# Altium project lamp_controller.PrjPcb (part 4 of 4)
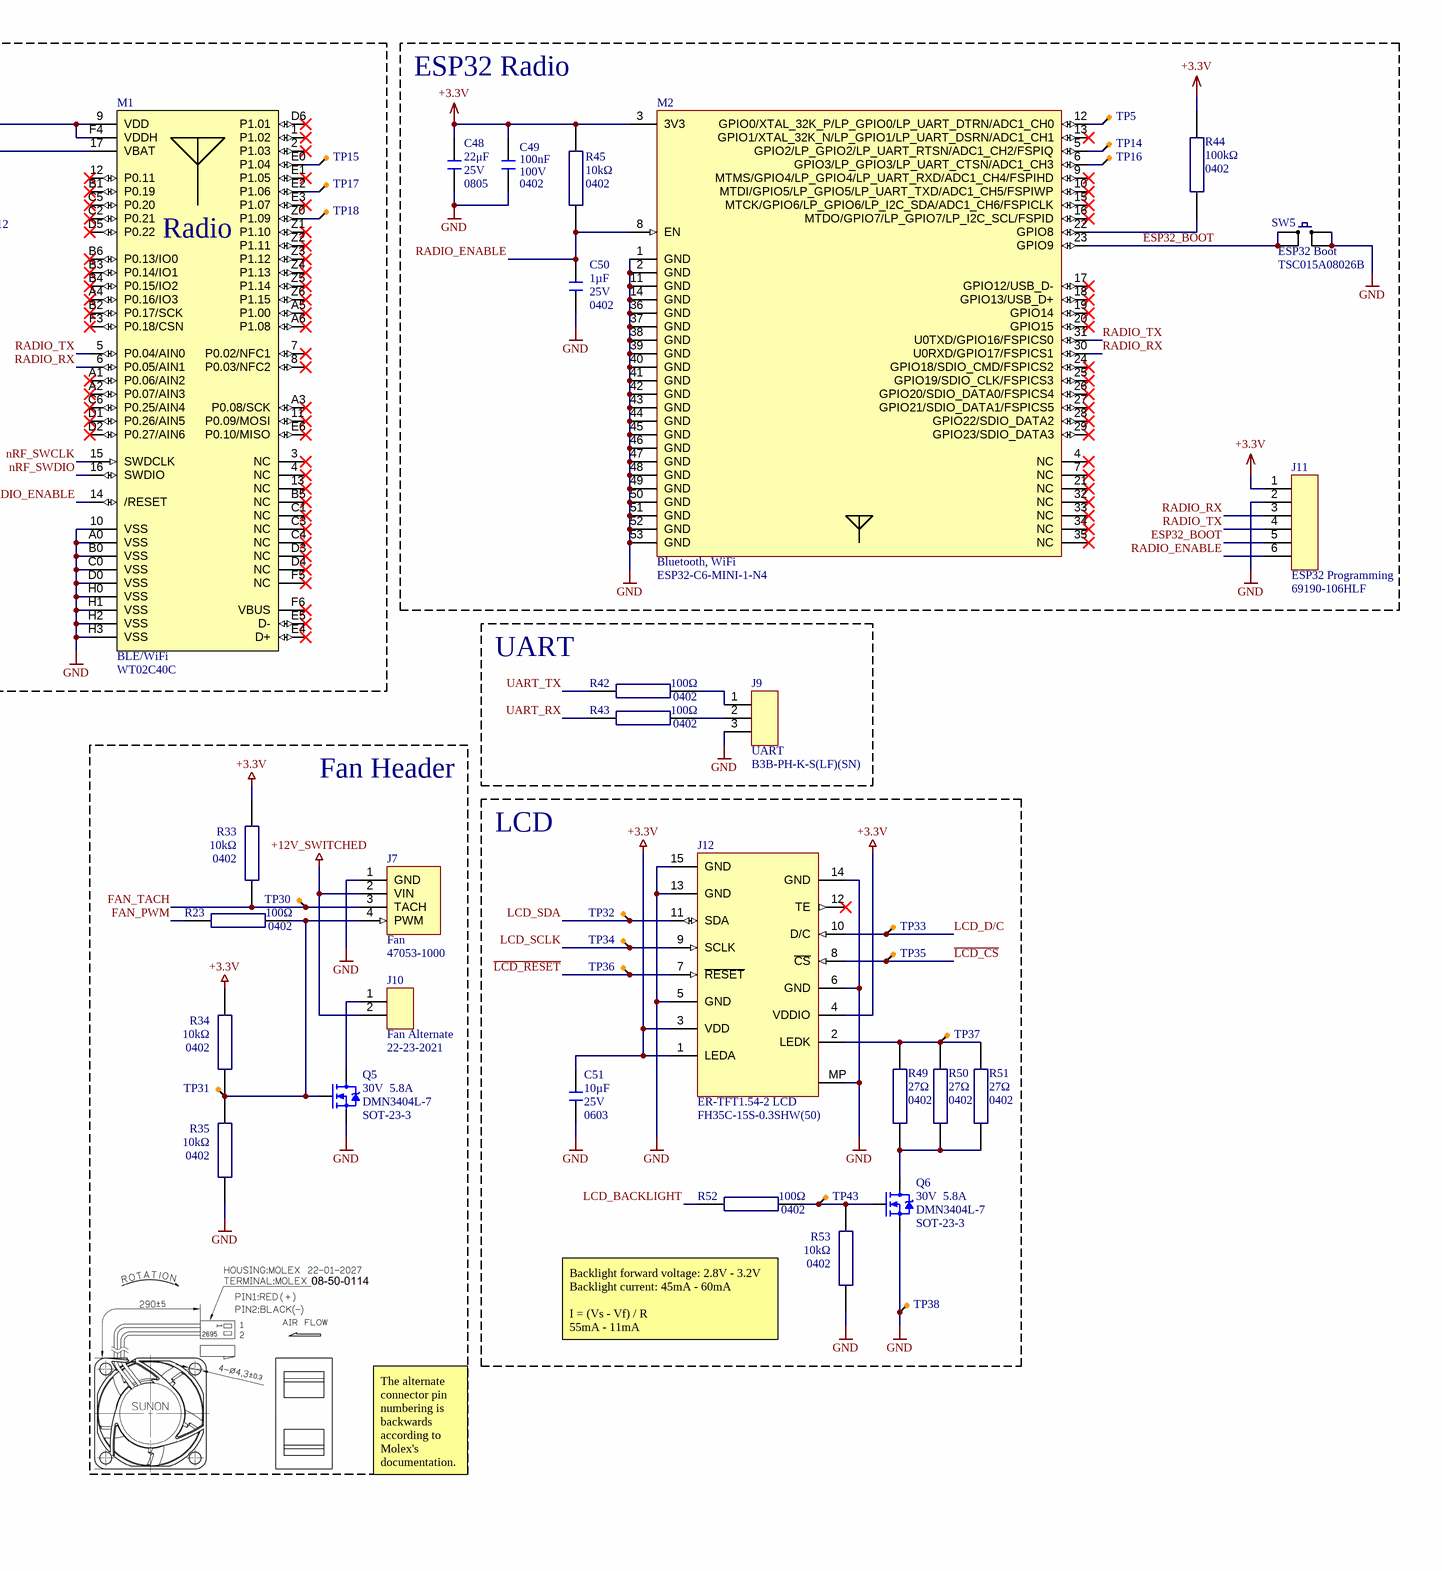
[diagram p5: lamp_controller.SchDoc, right]

## Sheet lamp_controller.SchDoc: Lamp Controller (continued)

### Library data of the parts
C8-C15 C18 C19 C35 C42-C44 C49 C52-C54 = GRM155R62A104KE14D: 100 nF, 100 V, X7R, 0402 Chip capacitor; Manufacturer: Murata; Dielectric Material: Ceramic; Multilayer: Yes; Tolerance  (fill in as +-): 10%; Temperature Characteristics Code: X5R; Supplier 1: LCSC; Supplier Part Number 1: C162178; RoHS: Yes; Category: Ceramic Capacitors; Pricing 1: 50=0.0085, 500=0.0066, 1500=0.0057, 10000=0.0051, 20000=0.0048, 50000=0.0047 (USD); Min Operating Temperature: -55°C; Max Operating Temperature: 85°C; Packaging: Tape and Reel; Termination: Wraparound; RoHS Compliant: Yes; ComponentLink1URL: https://datasheet.ciiva.com:443/pdfs/VipMasterIC/IC/MURE/MURE-S-A0004362469/MURE-S-A0004364737-1.pdf?src-supplier=IHS+Markit; ComponentLink1Description: https://datasheet.ciiva.com:443/pdfs/VipMasterIC/IC/MURE/MURE-S-A0004362469/MURE-S-A0004364737-1.pdf?src-supplier=IHS+Markit; ComponentLink2URL: http://www.farnell.com/datasheets/2079151.pdf?src-supplier=Farnell; ComponentLink2Description: http://www.farnell.com/datasheets/2079151.pdf?src-supplier=Farnell; ComponentLink3URL: http://www.mouser.com/ds/2/281/c02e-2905.pdf?src-supplier=Mouser; ComponentLink3Description: http://www.mouser.com/ds/2/281/c02e-2905.pdf?src-supplier=Mouser; ComponentLink4URL: http://www.farnell.com/datasheets/2079151.pdf?src-supplier=Element14; ComponentLink4Description: http://www.farnell.com/datasheets/2079151.pdf?src-supplier=Element14; ComponentLink5URL: http://www.farnell.com/datasheets/2079151.pdf?src-supplier=Newark; ComponentLink5Description: http://www.farnell.com/datasheets/2079151.pdf?src-supplier=Newark; ComponentLink6URL: https://datasheet.octopart.com/GRM155R62A104KE14D-Murata-datasheet-149523038.pdf?src-supplier=Newark; ComponentLink6Description: https://datasheet.octopart.com/GRM155R62A104KE14D-Murata-datasheet-149523038.pdf?src-supplier=Newark; ComponentLink7URL: https://datasheet.octopart.com/GRM155R62A104KE14D-Murata-datasheet-66077071.pdf?src-supplier=Element14; ComponentLink7Description: https://datasheet.octopart.com/GRM155R62A104KE14D-Murata-datasheet-66077071.pdf?src-supplier=Element14; ComponentLink8URL: http://search.murata.co.jp/Ceramy/image/img/A01X/G101/ENG/GRM155R62A104KE14-01.pdf?src-supplier=Digikey; ComponentLink8Description: http://search.murata.co.jp/Ceramy/image/img/A01X/G101/ENG/GRM155R62A104KE14-01.pdf?src-supplier=Digikey; ComponentLink9URL: https://datasheet.octopart.com/GRM155R62A104KE14D-Murata-datasheet-22122223.pdf?src-supplier=Future+Electronics; ComponentLink9Description: https://datasheet.octopart.com/GRM155R62A104KE14D-Murata-datasheet-22122223.pdf?src-supplier=Future+Electronics; Manufacturer Part Number: GRM155R62A104KE14D; Stock 1: 283300; Mounting Technology: Surface Mount; Pins: 2; Package Shape: Rectangular; Terminal Finish: Nickel; JESD-609 Code: e3; Capacitor Type: Ceramic; Tolerance (fill in as +-): 10%; Reach SVHC Compliant: Yes; ComponentLink10URL: https://datasheet.octopart.com/GRM155R62A104KE14D-Murata-datasheet-165579666.pdf?src-supplier=TME; ComponentLink10Description: https://datasheet.octopart.com/GRM155R62A104KE14D-Murata-datasheet-165579666.pdf?src-supplier=TME
C16 C17 C36 C50 = GRM155R61E105KA12D: 1 µF, 25 V, X5R, 0402 Chip capacitor; Manufacturer: Murata; house_part_number: C-1uF-0402-002; Dielectric Material: Ceramic; Multilayer: Yes; Negative Tolerance: 10%; Supplier 1: Digi-Key; Supplier Part Number 1: 490-10017-1-ND; RoHS: Yes; Category: Ceramic Capacitors; Stock 1: 145965; Pricing 1: 1=0.11000, 10=0.08300, 50=0.04560, 100=0.03720, 500=0.02656, 1000=0.02087, 2500=0.01898, 5000=0.01746 (USD); Mount: Surface Mount; Number of Pins: 2; Package Shape: Rectangular; Terminal Finish: Nickel; Min Operating Temperature: -55°C; Max Operating Temperature: 85°C; JESD-609 Code: e3; Capacitor Type: Ceramic; Package Style: SMTMeter; Packaging: Tape and Reel; Positive Tolerance: 10%; Temperature Characteristics Code: X5R; Termination: Wraparound; Length: 1mm; Width: 0.5mm; Height: 0.5mm; REACH SVHC: Yes; RoHS Compliant: Yes; ComponentLink1URL: https://datasheet.ciiva.com:443/pdfs/VipMasterIC/IC/MURE/MURE-S-A0004362469/MURE-S-A0004364524-1.pdf?src-supplier=IHS+Markit; ComponentLink1Description: https://datasheet.ciiva.com:443/pdfs/VipMasterIC/IC/MURE/MURE-S-A0004362469/MURE-S-A0004364524-1.pdf?src-supplier=IHS+Markit; ComponentLink2URL: https://datasheet.ciiva.com/7719/1666664-7719006.pdf?src-supplier=Element14; ComponentLink2Description: https://datasheet.ciiva.com/7719/1666664-7719006.pdf?src-supplier=Element14; ComponentLink3URL: https://datasheet.ciiva.com/22732/1666664-22732122.pdf?src-supplier=Element14; ComponentLink3Description: https://datasheet.ciiva.com/22732/1666664-22732122.pdf?src-supplier=Element14; Manufacturer Part Number: GRM155R61E105KA12D
C20 C21 = CC0402JRNPO9BN270: 27 pF, 25 V, X7R, 0402 Chip capacitor; Manufacturer: Yageo; house_part_number: C-27pF-0402-002; Tolerance: 5%; Dielectric: C0G; Supplier 1: Future Electronics; Manufacturer Part Number: CC0402JRNPO9BN270; RoHS: Yes; Category: Ceramic Capacitors; Mounting Technology: Surface Mount; Pins: 2; Min Operating Temperature: -55°C; Max Operating Temperature: 125°C; Packaging: Tape and Reel; Termination: SMD/SMT; Reach SVHC Compliant: No; RoHS Compliant: Yes; ComponentLink1URL: https://datasheet.ciiva.com/26862/getdatasheetpartid-403452-26862597.pdf?src-supplier=Verical; ComponentLink1Description: https://datasheet.ciiva.com/26862/getdatasheetpartid-403452-26862597.pdf?src-supplier=Verical; Supplier Part Number 1: 9741513; Stock: 1230000; Pricing: 10000=0.0024, 40000=0.0022, 150000=0.0021, 400000=0.002, 1000000=0.0019 (USD); Case Code (Metric): 1005; Case Code (Imperial): 0402; Voltage Rating: 50V; Package Quantity: 1; Series: CC; Length: 1mm; Width: 0.02inch; Thickness: 0.022inch; Depth: 0.5mm; Radiation Hardening: No; Lead Free: Lead Free; ComponentLink2URL: https://datasheet.ciiva.com/28450/1443161-28450249.pdf?src-supplier=Element14; ComponentLink2Description: https://datasheet.ciiva.com/28450/1443161-28450249.pdf?src-supplier=Element14; ComponentLink3URL: https://datasheet.ciiva.com/176/mlccorderingcode-176355.pdf?src-supplier=Digikey; ComponentLink3Description: https://datasheet.ciiva.com/176/mlccorderingcode-176355.pdf?src-supplier=Digikey; ComponentLink4URL: https://datasheet.ciiva.com/176/mlccorderingcode-176354.pdf?src-supplier=Digikey; ComponentLink4Description: https://datasheet.ciiva.com/176/mlccorderingcode-176354.pdf?src-supplier=Digikey; ComponentLink5URL: https://datasheet.ciiva.com/176/mlccorderingcode-176356.pdf?src-supplier=Digikey; ComponentLink5Description: https://datasheet.ciiva.com/176/mlccorderingcode-176356.pdf?src-supplier=Digikey; ComponentLink6URL: https://datasheet.ciiva.com/13386/upy-gp-np0-16v-to-50v-8-13386281.pdf?src-supplier=Mouser; ComponentLink6Description: https://datasheet.ciiva.com/13386/upy-gp-np0-16v-to-50v-8-13386281.pdf?src-supplier=Mouser
C34 C51 = CL10A106MA8NRNC: 10 µF, 25 V, X5R, 0603 Chip capacitor; Manufacturer: Samsung; house_part_number: C-10uF-0603-002; Tolerance: 20%; Material: 4241ConductorMaterial; RoHS: Yes; Category: Ceramic Capacitors; Case Code (Metric): 1608; Min Operating Temperature: -55°C; Max Operating Temperature: 85°C; Packaging: Cut Tape; RoHS Compliant: Yes; ComponentLink1URL: https://datasheet.ciiva.com/25766/cl10a106ma8nrnc-25766562.pdf?src-supplier=Digikey; ComponentLink1Description: https://datasheet.ciiva.com/25766/cl10a106ma8nrnc-25766562.pdf?src-supplier=Digikey; Manufacturer Part Number: CL10A106MA8NRNC; Case Code (Imperial): 0603; Stock: 632000; Pricing: 4000=0.0511, 8000=0.046, 12000=0.0434, 28000=0.0413, 100000=0.0356 (USD); Mounting Technology: Surface Mount; Series: CL; Height: 900um; Lead Free: Lead Free; Supplier Part Number 1: CL10A106MA8NRNC; Supplier 1: Arrow Electronics
C39-C41 C48 = GRT21BR61E226ME13L: 22 μF, 25 V, X5R, 0805 Chip capacitor; Manufacturer: Murata; Dielectric Material: Ceramic; Multilayer: Yes; Tolerance  (fill in as +-): 20%; Reference Standard: AEC-Q200; Supplier 1: Digi-Key; RoHS: Yes; Category: Ceramic Capacitors; Stock 1: 1983731; Pricing 1: 1=0.48, 10=0.338, 50=0.2558, 100=0.2228, 500=0.16508, 1000=0.14031 (USD); Mounting Technology: Surface Mount; Pins: 2; Package Shape: Rectangular; Terminal Finish: Nickel; Min Operating Temperature: -55°C; Max Operating Temperature: 85°C; JESD-609 Code: e3; Capacitor Type: Ceramic; Packaging: Tape and Reel; Tolerance (fill in as +-): 20%; Temperature Characteristics Code: X5R; Termination: Wraparound; Reach SVHC Compliant: Yes; RoHS Compliant: Yes; ComponentLink1URL: https://datasheet.ciiva.com:443/pdfs/VipMasterIC/IC/MURE/MURE-S-A0004410517/MURE-S-A0004413512-1.pdf?src-supplier=IHS+Markit; ComponentLink1Description: https://datasheet.ciiva.com:443/pdfs/VipMasterIC/IC/MURE/MURE-S-A0004410517/MURE-S-A0004413512-1.pdf?src-supplier=IHS+Markit; ComponentLink2URL: http://search.murata.co.jp/Ceramy/image/img/A01X/G101/ENG/GRT21BR61E226ME13-01.pdf?src-supplier=Digi-Key; ComponentLink2Description: http://search.murata.co.jp/Ceramy/image/img/A01X/G101/ENG/GRT21BR61E226ME13-01.pdf?src-supplier=Digi-Key; Manufacturer Part Number: GRT21BR61E226ME13L; Supplier Part Number 1: 490-12389-1-ND
J2 = B04B-XASK-1: 4-pin JST XA header, 2.5mm pitch, through-hole; Supplier 1: Digi-Key; Manufacturer: JST; RoHS: No; Category: Connectors; Stock 1: 159148; Pricing 1: 1=0.32, 10=0.269, 100=0.2093, 500=0.17938, 1000=0.14948, 5000=0.12812, 10000=0.11958 (USD); ComponentLink1URL: https://datasheet.ciiva.com/719/exa1-719638.pdf?src-supplier=Digi-Key; ComponentLink1Description: https://datasheet.ciiva.com/719/exa1-719638.pdf?src-supplier=Digi-Key; Supplier Part Number 1: 455-B04B-XASK-1-ND; Manufacturer Part Number: B04B-XASK-1
J4 J5 = debug_header: Tag-connect 6-pin pogo header; pickable: no
J6 = B05B-XASK-1(LF)(SN): 5-Pin JST XA header, 2.5mm pitch, through-hole; Supplier 1: LCSC; Manufacturer: JST; RoHS: Yes; Category: Headers and Wire Housings; Stock 1: 386434; Pricing 1: 5=0.0789, 50=0.0632, 150=0.0545, 400=0.0493, 2400=0.0448, 4800=0.0423 (USD); ComponentLink1URL: https://datasheet.ciiva.com/29316/741366-da-01-en-stiftleise-5-pol-rm-2-5mm-29316939.pdf?src-supplier=Conrad; ComponentLink1Description: https://datasheet.ciiva.com/29316/741366-da-01-en-stiftleise-5-pol-rm-2-5mm-29316939.pdf?src-supplier=Conrad; ComponentLink2URL: https://datasheet.ciiva.com/16417/exa1-16417502.pdf?src-supplier=Future+Electronics; ComponentLink2Description: https://datasheet.ciiva.com/16417/exa1-16417502.pdf?src-supplier=Future+Electronics; ComponentLink3URL: https://datasheet.ciiva.com/726/exa1-726107.pdf?src-supplier=Digikey; ComponentLink3Description: https://datasheet.ciiva.com/726/exa1-726107.pdf?src-supplier=Digikey; Supplier Part Number 1: C265079; Manufacturer Part Number: B05B-XASK-1(LF)(SN)
J7 = 470531000: 4-pin PC Fan connector; Manufacturer: Molex; Number of Positions: 4; Connector Type: Male Pin; Gender: Male; Pitch: 0.1inch; RoHS: Yes; Category: Headers and Wire Housings; Mount: Through Hole; Color: White; Contact Plating: Gold; Package Quantity: 2000; Number of Rows: 1; Fastening Type: Friction; Packaging: Bulk; Termination: Solder; Number of Contacts: 4; Contact Mating Length: 0.318inch; ComponentLink1URL: https://datasheet.ciiva.com/6839/022112026-sd-6839692.pdf?src-supplier=Digi-Key; ComponentLink1Description: https://datasheet.ciiva.com/6839/022112026-sd-6839692.pdf?src-supplier=Digi-Key; ComponentLink2URL: https://datasheet.ciiva.com/10090/022232051-sd-10090167.pdf?src-supplier=Avnet; ComponentLink2Description: https://datasheet.ciiva.com/10090/022232051-sd-10090167.pdf?src-supplier=Avnet
J8 = PPTC051LGBN-RC: 5-Pin angled female header with mmWave radar board.; Manufacturer: Sullins; Manufacturer Series: PP; Connector Type: BOARD CONNECTOR; Contact Pattern: RECTANGULAR; Contact Style: SQ PIN-SKT; Number Of Connectors: 1; Polarization Key: POLARIZED HOUSING; Rated Current (Signal): 3A; Number of Contacts: 5; Body Breadth: 0.094inch; Body Length: 0.52inch; Mating Contact Pitch: 0.1inch; Mounting Option 1: LOCKING; Reference Standard: UL; Reliability: COMMERCIAL; Supplier 1: Digikey; RoHS: Yes; Category: Connectors; Stock 1: 3109; Pricing 1: 1=0.56, 10=0.453, 80=0.37638, 440=0.32355, 1000=0.30082, 5000=0.2899 (USD); Mounting Technology: Board; Contact Material: Bronze; Contact Finish - Mating: SN; Contact Finish - Termination: TIN; Insulation Material: Polyester; Contact Gender: Female; Mounting Style: RIGHT ANGLE; Number Of PCB Rows: 1; Number of Rows Loaded: 1; PCB Contact Pattern: RECTANGULAR; Termination: Solder; Terminal Length: 0.125inch; Terminal Pitch: 2.54mm; Reach SVHC Compliant: Yes; RoHS Compliant: Yes; ComponentLink1URL: https://datasheet.ciiva.com:443/pdfs/VipMasterIC/IC/SUCS/SUCSS00270/SUCSS00270-1.pdf?src-supplier=IHS+Markit; ComponentLink1Description: https://datasheet.ciiva.com:443/pdfs/VipMasterIC/IC/SUCS/SUCSS00270/SUCSS00270-1.pdf?src-supplier=IHS+Markit; ComponentLink2URL: https://s3.amazonaws.com/catalogspreads-pdf/PAGE114-115%20.100%20FEMALE%20HDR.pdf?src-supplier=Digikey; ComponentLink2Description: https://s3.amazonaws.com/catalogspreads-pdf/PAGE114-115%20.100%20FEMALE%20HDR.pdf?src-supplier=Digikey; ComponentLink3URL: https://datasheet.octopart.com/PPTC051LGBN-RC-Sullins-datasheet-41308905.pdf?src-supplier=Future+Electronics; ComponentLink3Description: https://datasheet.octopart.com/PPTC051LGBN-RC-Sullins-datasheet-41308905.pdf?src-supplier=Future+Electronics; ComponentLink4URL: http://www.sullinscorp.com/catalogs/78_Page80-81_HEADER_.100_2.54mm_FEMALE.pdf?src-supplier=Future+Electronics; ComponentLink4Description: http://www.sullinscorp.com/catalogs/78_Page80-81_HEADER_.100_2.54mm_FEMALE.pdf?src-supplier=Future+Electronics; Supplier Part Number 1: S5441-ND; Manufacturer Part Number: PPTC051LGBN-RC
J9 = B3B-PH-K-S(LF)(SN): 3-Pin JST PH header, 2mm pitch, Through Hole; Number of Positions: 3; Current Rating: 2A; Contact Resistance: 20mR; Voltage Rating (AC): 100V; Insulation Resistance: 1MR; Gender: Male; Contact Post Length: 0.134inch; Mated Stacking Heights: 8mm; ComponentLink1URL: https://datasheet.ciiva.com/6747/80560-6747392.pdf; ComponentLink1Description: https://datasheet.ciiva.com/6747/80560-6747392.pdf; ComponentLink2URL: https://datasheet.ciiva.com/11746/0900766b8082f551-11746676.pdf; ComponentLink2Description: https://datasheet.ciiva.com/11746/0900766b8082f551-11746676.pdf; ComponentLink3URL: https://datasheet.ciiva.com/8052/80560-8052022.pdf; ComponentLink3Description: https://datasheet.ciiva.com/8052/80560-8052022.pdf; ComponentLink4URL: https://datasheet.ciiva.com/712/eph-712442.pdf; ComponentLink4Description: https://datasheet.ciiva.com/712/eph-712442.pdf; ComponentLink5URL: https://datasheet.ciiva.com/16422/b2b-ph-k-slfsn-16422715.pdf; ComponentLink5Description: https://datasheet.ciiva.com/16422/b2b-ph-k-slfsn-16422715.pdf; Supplier: Newark; Supplier Part Number: 37K9946; Manufacturer: JST; RoHS: Yes; Category: Headers and Wire Housings; Stock: 955386; Pricing: 1=0.03800, 10=0.03800, 100=0.03800, 500=0.03800, 1000=0.03800, 5000=0.03800, 10000=0.03800 (USD); Mounting Technology: Through Hole; Pins: 3; Contact Plating: Tin,Copper; Color: Natural; Contact Material: Brass; Housing Color: White; Housing Material: Polyamide; Contact Shape: Square; Contact Finish - Mating: TIN; Insulation Material: Nylon; Insulation Color: Natural; Min Operating Temperature: -25°C; Max Operating Temperature: 85°C; Number of Rows: 1; Packaging: Bulk; Connector Type: Header; Series: PH; Contact Type: Male Pin; Max Current Rating: 2A; Number of Poles: 3; Voltage Rating: 100V; Termination: Press-Fit; Fastening Type: Detent; Number of Contacts: 3; Max Voltage Rating (AC): 100V; Max Voltage Rating (DC): 100V; Working Voltage: 100V; Orientation: Straight; Length: 7.9mm; Width: 4.5mm; Height: 9.4mm; Pitch: 2mm; Lead Pitch: 2mm; Contact Mating Length: 0.13inch; Depth: 4.5mm; Insulation Height: 0.236inch; Lead Free: Lead Free; Reach SVHC Compliant: Yes; Flammability Rating: UL94 V-0; ComponentLink6URL: https://datasheet.ciiva.com/6747/80560-6747401.pdf?src-supplier=Newark; ComponentLink6Description: https://datasheet.ciiva.com/6747/80560-6747401.pdf?src-supplier=Newark; ComponentLink7URL: https://datasheet.ciiva.com/11746/0900766b80826550-11746939.pdf?src-supplier=Rs; ComponentLink7Description: https://datasheet.ciiva.com/11746/0900766b80826550-11746939.pdf?src-supplier=Rs; ComponentLink8URL: https://datasheet.ciiva.com/16200/eph-16200926.pdf?src-supplier=Future+Electronics; ComponentLink8Description: https://datasheet.ciiva.com/16200/eph-16200926.pdf?src-supplier=Future+Electronics; ComponentLink9URL: https://datasheet.ciiva.com/26894/getdatasheetpartid-448114-26894774.pdf?src-supplier=Verical; ComponentLink9Description: https://datasheet.ciiva.com/26894/getdatasheetpartid-448114-26894774.pdf?src-supplier=Verical; ComponentLink10URL: https://datasheet.ciiva.com/26924/getdatasheetpartid-651387-26924028.pdf?src-supplier=Verical; ComponentLink10Description: https://datasheet.ciiva.com/26924/getdatasheetpartid-651387-26924028.pdf?src-supplier=Verical; ComponentLink11URL: https://datasheet.ciiva.com/712/eph-712455.pdf?src-supplier=Digi-Key; ComponentLink11Description: https://datasheet.ciiva.com/712/eph-712455.pdf?src-supplier=Digi-Key; ComponentLink12URL: https://datasheet.ciiva.com/43491/741202-da-01-en-stiftleiste-gerade-3-pol-rm2-0-43491962.pdf?src-supplier=Conrad; ComponentLink12Description: https://datasheet.ciiva.com/43491/741202-da-01-en-stiftleiste-gerade-3-pol-rm2-0-43491962.pdf?src-supplier=Conrad; Manufacturer Part Number: B3B-PH-K-S(LF)(SN)
J10 = 22-23-2021: 2-Pin 0.1" header, through-hole; Manufacturer: Molex; Connector Type: BOARD CONNECTOR; Option: General Purpose; Body/Shell Style: RECEPTACLE; Contact Pattern: RECTANGULAR; Contact Resistance: 10mR; Contact Style: SQ PIN-SKT; Filter Feature: No; Insertion Force-Max: 4.8928N; Insulation Resistance: 1GR; Mating Information: MULTIPLE MATING PARTS AVAILABLE; Number Of Connectors: 1; Number of Contacts: 2; Body Breadth: 0.25inch; Body Depth: 0.322inch; Body Length: 0.194inch; Mating Contact Pitch: 0.1inch; Mounting Option 1: FRICTION LOCK; Mounting Option 2: LOCKING; Plating Thickness: 100uin; Reference Standard: UL; Reliability: COMMERCIAL; Supplier 1: LCSC; RoHS: Yes; Category: Headers and Wire Housings; Stock 1: 9755; Pricing 1: 5=0.0881, 50=0.0704, 150=0.0615, 500=0.0548, 2850=0.0481, 5700=0.0454 (USD); Mounting Technology: Board; Contact Material: Brass; Contact Finish - Mating: NOT SPECIFIED; Contact Finish - Termination: Matte Tin/Copper (Sn/Cu); Insulation Color: White; Insulation Material: Nylon; JESD-609 Code: e2; Contact Gender: Male; Mixed Contacts: No; Mounting Style: STRAIGHT; Number Of PCB Rows: 1; Number of Rows Loaded: 1; PCB Contact Pattern: RECTANGULAR; Termination: Solder; Terminal Length: 0.14inch; Terminal Pitch: 2.54mm; Flammability Rating: UL94 V-0; DIN Conformance: No; IEC Conformance: No; MIL Conformance: No; Reach SVHC Compliant: Yes; RoHS Compliant: Yes; ComponentLink1URL: https://datasheet.ciiva.com:443/pdfs/VipMasterIC/IC/MOLE/MOLE-S-A0002956908/MOLE-S-A0002956550-1.pdf?src-supplier=IHS+Markit; ComponentLink1Description: https://datasheet.ciiva.com:443/pdfs/VipMasterIC/IC/MOLE/MOLE-S-A0002956908/MOLE-S-A0002956550-1.pdf?src-supplier=IHS+Markit; ComponentLink2URL: https://datasheet.ciiva.com/11746/0900766b80d8f4d1-11746058.pdf?src-supplier=Rs; ComponentLink2Description: https://datasheet.ciiva.com/11746/0900766b80d8f4d1-11746058.pdf?src-supplier=Rs; ComponentLink3URL: https://datasheet.ciiva.com/22683/1834442-22683561.pdf?src-supplier=Element14; ComponentLink3Description: https://datasheet.ciiva.com/22683/1834442-22683561.pdf?src-supplier=Element14; Supplier Part Number 1: C234180; Manufacturer Part Number: 22-23-2021
J11 = 69190-106HLF: 6-Pin 0.1" unshrouded header pins; Manufacturer: Amphenol ICC / FCI; Manufacturer Series: 69190; Connector Type: BOARD CONNECTOR; Option: General Purpose; Contact Pattern: RECTANGULAR; Contact Style: SQ PIN-SKT; Filter Feature: No; Number Of Connectors: 1; Number of Contacts: 6; Body Breadth: 0.095inch; Body Depth: 0.1inch; Body Length: 0.6inch; Mounting Option 1: LOCKING; Plating Thickness: 30uin; Reference Standard: UL; Reliability: COMMERCIAL; Supplier 1: Mouser; RoHS: Yes; Category: Connectors; Pricing 1: 1=0.67, 10=0.521, 50=0.521, 100=0.457, 1000=0.343, 10000=0.309 (USD); Mounting Technology: Board; Contact Material: Bronze; Contact Finish - Termination: GOLD (30) OVER NICKEL/NICKEL PALLADIUM GOLD (30) OVER NICKEL; Insulation Color: Black; JESD-609 Code: e4; Contact Gender: Male; Mixed Contacts: No; Mounting Style: STRAIGHT; Number Of PCB Rows: 1; Number of Rows Loaded: 1; PCB Contact Pattern: RECTANGULAR; Termination: Solder; Mating Contact Pitch: 0.1inch; Terminal Length: 0.12inch; Terminal Pitch: 2.54mm; Flammability Rating: UL94 V-0; DIN Conformance: No; IEC Conformance: No; MIL Conformance: No; Reach SVHC Compliant: Yes; RoHS Compliant: Yes; ComponentLink1URL: https://datasheet.ciiva.com/721/69190-721132.pdf?src-supplier=Digikey; ComponentLink1Description: https://datasheet.ciiva.com/721/69190-721132.pdf?src-supplier=Digikey; Supplier Part Number 1: 649-69190-106HLF; Manufacturer Part Number: 69190-106HLF
J12 = LCD Connector: ER-TFT1.54-2 1.54" IPS LCD, 240x240, ST7789 controller, FH35C-15S-0.3SHW(50) connector; Manufacturer: HRS; Connector Type: CARD EDGE CONNECTOR; Contact Pattern: STAGGERED; Contact Resistance: 100mR; Contact Style: BELLOWED TYPE; Dielectric Withstanding Voltage (AC): 90V; Durability: 10Cycles; Insulation Resistance: 50MR; Number Of PCB Rows: 2; Rated Current (Signal): 200mA; Number of Contacts: 15; Body Breadth: 0.035inch; Body Depth: 0.132inch; Body Length: 0.24inch; Mating Contact Pitch: 0.024inch; Mounting Option 1: LOCKING; PCB Contact Row Spacing: 2.8702mm; Reliability: COMMERCIAL; Supplier 1: Digikey; Category: FFC / FPC; Stock 1: 3489; Pricing 1: 1=1.87, 10=1.525, 25=1.4056, 50=1.3216, 100=1.2428, 250=1.14576, 500=1.07746, 1000=1.01326, 2500=0.9375 (USD); Mounting Technology: Board; Contact Material: Bronze; Contact Finish - Mating: AU ON NI; Min Operating Temperature: -55°C; Max Operating Temperature: 85°C; Mounting Style: RIGHT ANGLE; Number of Rows Loaded: 2; PCB Contact Pattern: STAGGERED; Termination: SMD/SMT; Terminal Pitch: 0.6096mm; RoHS Compliant: Yes; ComponentLink1URL: https://datasheet.ciiva.com:443/pdfs/VipMasterIC/IC/HIRO/HIRO-S-A0001800865/HIRO-S-A0001800865-1.pdf?src-supplier=IHS+Markit; ComponentLink1Description: https://datasheet.ciiva.com:443/pdfs/VipMasterIC/IC/HIRO/HIRO-S-A0001800865/HIRO-S-A0001800865-1.pdf?src-supplier=IHS+Markit; ComponentLink2URL: https://datasheet.ciiva.com/29758/ed-fh35c-20140305-29758967.pdf?src-supplier=Digikey; ComponentLink2Description: https://datasheet.ciiva.com/29758/ed-fh35c-20140305-29758967.pdf?src-supplier=Digikey; Supplier Part Number 1: 26-FH35C-15S-0.3SHW(50)CT-ND; Manufacturer Part Number: FH35C-15S-0.3SHW(50)
M1 = WT02C40C: nRF5340 BLE/WIFI module; Manufacturer Part Number: WT02C40C
M2 = ESP32-C6-MINI-1-N4: ESP32-C6 chipset, PCB antenna, SMD-53; Manufacturer: Espressif Systems; Supplier 1: Digikey; RoHS: No; Category: LDO; Stock 1: 3251; Pricing 1: 1=2.5 (USD); Supplier Part Number 1: 1965-ESP32-C6-MINI-1-N4CT-ND; Manufacturer Part Number: ESP32-C6-MINI-1-N4
Q1 Q5 Q6 = DMN3404L-7: N-FET, 30 V, 5.8 A, SOT-23-3; Manufacturer: Diodes; Package Body Material: Plastic; Transistor Element Material: SILICON; Polarity/Channel Type: N-CHANNEL; Additional Feature: HIGH RELIABILITY; Drain-source On Resistance-Max: 28mR; FET Technology: METAL-OXIDE SEMICONDUCTOR; Number of Elements: 1; Operating Mode: ENHANCEMENT MODE; Power Dissipation-Max (Abs): 1.4W; Pulsed Drain Current-Max (IDM): 30A; Time @ Peak Reflow Temperature-Max (s): 40s; Transistor Application: SWITCHING; Qualification Status: Not Qualified; Supplier 1: Digi-Key; RoHS: Yes; Category: MOSFETs; Stock 1: 150000; Pricing 1: 3000=0.07535, 6000=0.06781, 15000=0.06028, 30000=0.05651, 75000=0.05011, 150000=0.04822 (USD); Pins: 3; Package Shape: Rectangular; Terminal Finish: Tin; Max Operating Temperature: 150°C; JESD-609 Code: e3; Drain Current-Max (Abs) (ID): 5.8A; JESD-30 Code: R-PDSO-G3; Moisture Sensitivity Level: 1; Package Style: SMALL OUTLINEMeter; Peak Reflow Temperature (Cel): 260°C; Surface Mount: Yes; Terminal Form: Gull Wing; Terminal Position: DUAL; Reach SVHC Compliant: Yes; RoHS Compliant: Yes; ComponentLink1URL: https://datasheet.ciiva.com:443/pdfs/VipMasterIC/IC/DIOD/DIODS20277/DIODS20277-1.pdf?src-supplier=IHS+Markit; ComponentLink1Description: https://datasheet.ciiva.com:443/pdfs/VipMasterIC/IC/DIOD/DIODS20277/DIODS20277-1.pdf?src-supplier=IHS+Markit; ComponentLink2URL: https://datasheet.ciiva.com/4444/ds31787-65102-4444489.pdf?src-supplier=Mouser; ComponentLink2Description: https://datasheet.ciiva.com/4444/ds31787-65102-4444489.pdf?src-supplier=Mouser; ComponentLink3URL: https://datasheet.ciiva.com/8115/ds31787-8115384.pdf?src-supplier=Avnet; ComponentLink3Description: https://datasheet.ciiva.com/8115/ds31787-8115384.pdf?src-supplier=Avnet; ComponentLink4URL: https://datasheet.ciiva.com/16508/ds31787-16508477.pdf?src-supplier=Future+Electronics; ComponentLink4Description: https://datasheet.ciiva.com/16508/ds31787-16508477.pdf?src-supplier=Future+Electronics; ComponentLink5URL: https://datasheet.ciiva.com/8023/ds31787-8023981.pdf?src-supplier=Element14; ComponentLink5Description: https://datasheet.ciiva.com/8023/ds31787-8023981.pdf?src-supplier=Element14; ComponentLink6URL: https://datasheet.ciiva.com/934/ds31787-934594.pdf?src-supplier=Digi-Key; ComponentLink6Description: https://datasheet.ciiva.com/934/ds31787-934594.pdf?src-supplier=Digi-Key; ComponentLink7URL: https://datasheet.ciiva.com/934/ds31787-934595.pdf?src-supplier=Digi-Key; ComponentLink7Description: https://datasheet.ciiva.com/934/ds31787-934595.pdf?src-supplier=Digi-Key; ComponentLink8URL: https://datasheet.ciiva.com/934/ds31787-934593.pdf?src-supplier=Digi-Key; ComponentLink8Description: https://datasheet.ciiva.com/934/ds31787-934593.pdf?src-supplier=Digi-Key; Supplier Part Number 1: DMN3404LDITR-ND; Package: SOT-23-3; Manufacturer Part Number: DMN3404L-7
R3 R12 R31-R36 R40 R45 R53 = RMCF0402FT10K0: 10 kΩ, 0402 Chip resistor; Manufacturer: Stackpole Electronics; house_part_number: R-10k-0402-1%-001; Tolerance: 1%; Power Rating: 62.5mW; Temperature Coefficient: 100ppm/°C; Max Power Dissipation: 63mW; Supplier 1: Digi-Key; Manufacturer Part Number: RMCF0402FT10K0; RoHS: Yes; Category: Chip SMD Resistors; Stock 1: 7219214; Pricing 1: 1=0.10000, 10=0.01300, 100=0.00530, 1000=0.00239, 2500=0.00207, 5000=0.00171 (USD); Mount: Surface Mount; Case/Package: 0402; Case Code (Metric): 1005; Contact Plating: Tin,Matte; Size Code: 0402; Min Operating Temperature: -55°C; Max Operating Temperature: 155°C; Packaging: Tape and Reel; Resistor Type: Thick Film; Number of Terminations: 2; Features: Automotive AEC-Q200; Series: RMCF; Construction: Rectangular; Length: 1mm; Width: 0.02inch; Height: 0.016inch; Depth: 0.5mm; Radiation Hardening: No; Military Standard: Not; Lead Free: Lead Free; RoHS Compliant: Yes; ComponentLink1URL: https://datasheet.ciiva.com/24341/sei-rmcp-24341800.pdf?src-supplier=Onlinecomponents.com; ComponentLink1Description: https://datasheet.ciiva.com/24341/sei-rmcp-24341800.pdf?src-supplier=Onlinecomponents.com; Supplier Part Number 1: RMCF0402FT10K0CT-ND
R7 R23 R37 R38 R42 R43 R47 R48 R52 R55 = RMCF0402FT100R: 100 Ω, 0402 Chip resistor; Manufacturer: Stackpole Electronics; house_part_number: R-100-0402-1%-001; Power Rating: 62.5mW; Tolerance: 1%; Max Power Dissipation: 63mW; Temperature Coefficient: 100ppm/°C; Supplier 1: Digi-Key; Supplier Part Number 1: RMCF0402FT100RCT-ND; RoHS: Yes; Category: Chip SMD Resistors; Stock 1: 188482; Pricing 1: 1=0.10000, 10=0.01300, 100=0.00530, 1000=0.00238, 2500=0.00207, 5000=0.00171 (USD); Mount: Surface Mount; Case/Package: 0402; Case Code (Metric): 1005; Contact Plating: Tin,Matte; Min Operating Temperature: -55°C; Max Operating Temperature: 155°C; Packaging: Tape and Reel; Resistor Type: Thick Film; Number of Terminations: 2; Features: Automotive AEC-Q200; Series: RMCF; Construction: Rectangular; Length: 1mm; Width: 0.02inch; Height: 0.016inch; Depth: 0.5mm; Military Standard: Not; Lead Free: Lead Free; RoHS Compliant: Yes; ComponentLink1URL: http://components.arrow.com/part/dataview/50497758S7215546N1174?src-supplier=Arrow+Electronics; ComponentLink1Description: http://components.arrow.com/part/dataview/50497758S7215546N1174?src-supplier=Arrow+Electronics; ComponentLink2URL: https://www.seielect.com/catalog/sei-rmcf_rmcp.pdf?src-supplier=Digi-Key; ComponentLink2Description: https://www.seielect.com/catalog/sei-rmcf_rmcp.pdf?src-supplier=Digi-Key; ComponentLink3URL: https://www.seielect.com/Catalog/SEI-RMCF_RMCP.pdf?src-supplier=Avnet; ComponentLink3Description: https://www.seielect.com/Catalog/SEI-RMCF_RMCP.pdf?src-supplier=Avnet; ComponentLink4URL: https://www.verical.com/server-webapp/html/getDatasheet?partID=368652&src-supplier=Verical; ComponentLink4Description: https://www.verical.com/server-webapp/html/getDatasheet?partID=368652&src-supplier=Verical; ComponentLink5URL: https://www.seielect.com/Catalog/SEI-RMCF_RMCP.pdf?src-supplier=Avnet+Asia; ComponentLink5Description: https://www.seielect.com/Catalog/SEI-RMCF_RMCP.pdf?src-supplier=Avnet+Asia; Manufacturer Part Number: RMCF0402FT100R
R13 = RMCF0402ZT0R00: 0 Ω, 0402 Jumper; Manufacturer: Stackpole Electronics; house_part_number: JP-0402-001; Power Rating: 63mW; Current Rating: 1A; Working Voltage: 50V; Supplier 1: Digi-Key; Supplier Part Number 1: RMCF0402ZT0R00CT-ND; RoHS: Yes; Category: Chip SMD Resistors; Stock 1: 6500003; Pricing 1: 1=0.10000, 10=0.01000, 25=0.00720, 50=0.00560, 100=0.00410, 250=0.00316, 500=0.00252, 1000=0.00186, 5000=0.00133 (USD); Mount: Surface Mount; Case Code (Metric): 1005; Case Code (Imperial): 0402; Contact Plating: Tin,Matte; Min Operating Temperature: -55°C; Max Operating Temperature: 155°C; Packaging: Tape and Reel; Resistor Type: Thick Film; Number of Terminations: 2; Max Power Dissipation: 63mW; Features: Automotive AEC-Q200; Series: RMCF; Technology: THICK FILM; Construction: Rectangular; Length: 0.039inch; Width: 0.02inch; Height: 0.016inch; Depth: 0.5mm; Radiation Hardening: No; Military Standard: Not; Lead Free: Lead Free; RoHS Compliant: Yes; ComponentLink1URL: https://datasheet.ciiva.com/26835/getdatasheetpartid-409751-26835612.pdf?src-supplier=Verical; ComponentLink1Description: https://datasheet.ciiva.com/26835/getdatasheetpartid-409751-26835612.pdf?src-supplier=Verical; Manufacturer Part Number: RMCF0402ZT0R00
R15 R22 R24 R46 = CR0402-FX-1001GLF: 1 kΩ, 0402 Chip resistor; Manufacturer: Bourns; Tolerance: 1%; Rated Power Dissipation (P): 62.5mW; Rated Temperature: 70°C; Temperature Coefficient: 100ppm/°C; Working Voltage: 50V; Package Height: 0.35mm; Package Length: 1mm; Package Width: 0.5mm; Supplier 1: Digi-Key; Manufacturer Part Number: CR0402-FX-1001GLF; RoHS: Yes; Category: Chip SMD Resistors; Stock 1: 398310; Pricing 1: 10000=0.00114 (USD); Mount: Surface Mount; Number of Pins: 2; Package Shape: Rectangular; Terminal Finish: Nickel; Min Operating Temperature: -55°C; Max Operating Temperature: 125°C; JESD-609 Code: e3; Resistor Type: FIXED RESISTOR; Construction: Chip; Package Style: SMTMeter; Packaging: Tape and Reel; Technology: RUTHENIUM OXIDE; Termination: Wraparound; REACH SVHC: Yes; RoHS Compliant: Yes; ComponentLink1URL: https://datasheet.ciiva.com:443/pdfs/VipMasterIC/IC/BOUR/BOUR-S-A0008953887/BOUR-S-A0008953887-1.pdf?src-supplier=IHS+Markit; ComponentLink1Description: https://datasheet.ciiva.com:443/pdfs/VipMasterIC/IC/BOUR/BOUR-S-A0008953887/BOUR-S-A0008953887-1.pdf?src-supplier=IHS+Markit; ComponentLink2URL: https://datasheet.ciiva.com/5734/1845296-5734926.pdf?src-supplier=Farnell; ComponentLink2Description: https://datasheet.ciiva.com/5734/1845296-5734926.pdf?src-supplier=Farnell; ComponentLink3URL: https://datasheet.ciiva.com/11821/0900766b80fcdb41-11821108.pdf?src-supplier=RSComponents; ComponentLink3Description: https://datasheet.ciiva.com/11821/0900766b80fcdb41-11821108.pdf?src-supplier=RSComponents; ComponentLink4URL: https://datasheet.ciiva.com/9123/cr0402-9123631.pdf?src-supplier=Avnet; ComponentLink4Description: https://datasheet.ciiva.com/9123/cr0402-9123631.pdf?src-supplier=Avnet; ComponentLink5URL: https://datasheet.ciiva.com/30154/cr0402-30154590.pdf?src-supplier=Onlinecomponents.com; ComponentLink5Description: https://datasheet.ciiva.com/30154/cr0402-30154590.pdf?src-supplier=Onlinecomponents.com; Supplier Part Number 1: CR0402-FX-1001GLFTR-ND
R25 R26 R49-R51 = RMCF0402FT27R0: 27 Ω, 0402 Chip resistor; Manufacturer: Stackpole Electronics; house_part_number: R-27-0402-1%-001; Tolerance: 1%; Rated Power Dissipation (P): 63mW; Rated Temperature: 70°C; Temperature Coefficient: 100ppm/°C; Working Voltage: 50V; Package Height: 0.3mm; Package Length: 1mm; Package Width: 0.5mm; Reference Standard: AEC-Q200; Supplier 1: Digi-Key; Supplier Part Number 1: RMCF0402FT27R0CT-ND; RoHS: Yes; Category: Chip SMD Resistors; Stock 1: 3710; Pricing 1: 1=0.10000, 10=0.01500, 100=0.00610, 1000=0.00274, 2500=0.00238, 5000=0.00197 (USD); Mount: Surface Mount; Number of Pins: 2; Package Shape: Rectangular; Terminal Finish: Nickel; Min Operating Temperature: -55°C; Max Operating Temperature: 155°C; JESD-609 Code: e3; Resistor Type: FIXED RESISTOR; Construction: Rectangular; Package Style: SMTMeter; Packaging: Tape and Reel; Technology: METAL GLAZE/THICK FILM; Termination: Wraparound; REACH SVHC: Yes; RoHS Compliant: Yes; ComponentLink1URL: https://datasheet.ciiva.com:443/pdfs/VipMasterIC/IC/SEIE/SEIE-S-A0009541969/SEIE-S-A0009541969-1.pdf?src-supplier=IHS+Markit; ComponentLink1Description: https://datasheet.ciiva.com:443/pdfs/VipMasterIC/IC/SEIE/SEIE-S-A0009541969/SEIE-S-A0009541969-1.pdf?src-supplier=IHS+Markit; ComponentLink2URL: https://www.seielect.com/catalog/SEI-RMCF_RMCP.pdf?src-supplier=Avnet; ComponentLink2Description: https://www.seielect.com/catalog/SEI-RMCF_RMCP.pdf?src-supplier=Avnet; ComponentLink3URL: https://www.seielect.com/catalog/sei-rmcf_rmcp.pdf?src-supplier=Digi-Key; ComponentLink3Description: https://www.seielect.com/catalog/sei-rmcf_rmcp.pdf?src-supplier=Digi-Key; ComponentLink4URL: http://www.seielect.com/Catalog/SEI-RMCF_RMCP.pdf?src-supplier=Digi-Key; ComponentLink4Description: http://www.seielect.com/Catalog/SEI-RMCF_RMCP.pdf?src-supplier=Digi-Key; Manufacturer Part Number: RMCF0402FT27R0
R44 = RMCF0402FT100K: 100 kΩ, 0402 Chip resistor; Manufacturer: Stackpole Electronics; Tolerance: 1%; Power: 63mW; Rated Temperature: 70°C; Temperature Coefficient: 100ppm/°C; Working Voltage: 50V; Package Height: 0.3mm; Package Length: 1mm; Package Width: 0.5mm; Reference Standard: AEC-Q200; Supplier 1: Digi-Key; Manufacturer Part Number: RMCF0402FT100K; RoHS: Yes; Category: Chip SMD Resistors; Stock 1: 3573736; Pricing 1: 1=0.1, 10=0.02, 50=0.011, 100=0.0089, 500=0.00566, 1000=0.00475, 5000=0.00328 (USD); Mounting Technology: Surface Mount; Pins: 2; Package Shape: Rectangular; Terminal Finish: Nickel; Min Operating Temperature: -55°C; Max Operating Temperature: 155°C; JESD-609 Code: e3; Resistor Type: FIXED RESISTOR; Construction: Rectangular; Package Style: SMTMeter; Packaging: Tape and Reel; Technology: METAL GLAZE/THICK FILM; Termination: Wraparound; Reach SVHC Compliant: Yes; RoHS Compliant: Yes; ComponentLink1URL: https://datasheet.ciiva.com:443/pdfs/VipMasterIC/IC/SEIE/SEIE-S-A0009541969/SEIE-S-A0009541969-1.pdf?src-supplier=IHS+Markit; ComponentLink1Description: https://datasheet.ciiva.com:443/pdfs/VipMasterIC/IC/SEIE/SEIE-S-A0009541969/SEIE-S-A0009541969-1.pdf?src-supplier=IHS+Markit; ComponentLink2URL: https://datasheet.ciiva.com/15193/getdatasheetpartid-482656-15193415.pdf?src-supplier=Verical; ComponentLink2Description: https://datasheet.ciiva.com/15193/getdatasheetpartid-482656-15193415.pdf?src-supplier=Verical; Supplier Part Number 1: RMCF0402FT100KCT-ND
SW1-SW3 SW5-SW8 = TSC015A08026B: Tactile switch, SPST; house_part_number: SW-TAC-4.5-8-260gf; Mechanical Life: 100000Cycles; Illumination Type: Non-Illuminated; Switch Function: Off-Mom; Actuator Type: Standard; Operating Force: 260gf; Switch Travel: 0.25mm; Ratings: IP40; RoHS: No; Category: Tactile Switches; Stock 1: 68566; Pricing 1: 1=0.13000, 10=0.12700, 25=0.12080, 100=0.10970, 250=0.10308, 500=0.09432, 1000=0.07897 (USD); Mount: Surface Mount; Min Operating Temperature: -20°C; Max Operating Temperature: 70°C; Throw Configuration: SPST; Packaging: Tape and Reel; Termination: Gull Wing; ComponentLink1URL: https://www.ckswitches.com/media/2567/pts647.pdf?src-supplier=Digi-Key; ComponentLink1Description: https://www.ckswitches.com/media/2567/pts647.pdf?src-supplier=Digi-Key; Height: 8mm; Manufacturer Part Number: TSC015A08026B
SW4 = TSC015A06026A: Tactile switch, SPST, 6mm tall; Mechanical Life: 100000Cycles; Illumination Type: Non-Illuminated; Switch Function: Off-Mom; Actuator Type: Standard; Operating Force: 260gf; Switch Travel: 0.25mm; Ratings: IP40; RoHS: No; Category: Tactile Switches; Mount: Surface Mount; Min Operating Temperature: -20°C; Max Operating Temperature: 70°C; Throw Configuration: SPST; Packaging: Tape and Reel; Termination: Gull Wing; ComponentLink1URL: https://www.ckswitches.com/media/2567/pts647.pdf?src-supplier=Digi-Key; ComponentLink1Description: https://www.ckswitches.com/media/2567/pts647.pdf?src-supplier=Digi-Key; Height: 6mm; Manufacturer Part Number: TSC015A06026A
TP5 TP7 TP10 TP12-TP18 TP21 TP23 TP30-TP38 TP43 = test_point-1: Test point; pickable: no
U2 = W25Q128JVSIM TR: 128Mb SPI flash memory; Manufacturer: Winbond; Memory Type: Non-Volatile,FLASH; Frequency: 133MHz; Supplier 1: Digi-Key; Stock 1: 0; Pricing 1: 1=1.69, 10=1.545, 25=1.5028, 50=1.495, 100=1.3364, 250=1.3325, 500=1.3124, 1000=1.2567 (USD); Mount: Surface Mount; Number of Pins: 8; Min Operating Temperature: -40°C; Max Operating Temperature: 85°C; Packaging: Cut Tape; Memory Size: 128Mb; ComponentLink1URL: http://www.winbond.com/resource-files/w25q128jv_dtr%20revc%2003272018%20plus.pdf?src-supplier=Digi-Key; ComponentLink1Description: http://www.winbond.com/resource-files/w25q128jv_dtr%20revc%2003272018%20plus.pdf?src-supplier=Digi-Key; Supplier Part Number 1: W25Q128JVSIMCT-ND; house_part_number: W25Q128JVSIM; Manufacturer Part Number: W25Q128JVSIM TR
U3 = RP2040: Raspberry Pi microcontroller, QFN-56; Manufacturer: Raspberry Pi; Supplier: Newark; Supplier Part Number: 49AJ8739; RoHS: No; Category: Uncategorized; Stock: 720; Pricing: 1=1 (USD); Manufacturer Part Number: RP2040; Package: QFN-56
U7 = LIS3DHTR: 3-Axis accelerometer, 16-bit, I2C/SPI, LGA-16; Manufacturer: STMicroelectronics; Max Supply Voltage: 3.6V; Min Supply Voltage: 1.71V; Operating Supply Voltage: 2.5V; Bandwidth: 5kHz; Interface: I2C,SPI; Resolution: 16b; Operating Supply Current: 11uA; Sensor Type: 3 Axis; Output Type: Digital; Axis: X, Y, Z; Supplier: Avnet; Supplier Part Number: LIS3DHTR; RoHS: Yes; Category: Accelerometers; Stock: 40000; Pricing: 4000=0.94095, 8000=0.92155, 16000=0.90215 (USD); Pins: 16; Min Operating Temperature: -40°C; Max Operating Temperature: 85°C; Package Quantity: 4000; Packaging: Tape and Reel; Max Supply Voltage (DC): 3.6V; Min Supply Voltage (DC): 1.71V; Series: -; Length: 3mm; Width: 3mm; Height: 1mm; Depth: 3mm; Radiation Hardening: No; Reach SVHC Compliant: No; Lead Free: Lead Free; RoHS Compliant: Yes; ComponentLink1URL: https://datasheet.ciiva.com/7621/1718591-7621744.pdf?src-supplier=Element14; ComponentLink1Description: https://datasheet.ciiva.com/7621/1718591-7621744.pdf?src-supplier=Element14; ComponentLink2URL: https://datasheet.ciiva.com/5296/cd00274221-117431-5296513.pdf?src-supplier=Mouser; ComponentLink2Description: https://datasheet.ciiva.com/5296/cd00274221-117431-5296513.pdf?src-supplier=Mouser; ComponentLink3URL: https://datasheet.ciiva.com/2810/cd00274221-2810009.pdf?src-supplier=Digikey; ComponentLink3Description: https://datasheet.ciiva.com/2810/cd00274221-2810009.pdf?src-supplier=Digikey; ComponentLink4URL: https://datasheet.ciiva.com/2810/cd00274221-2810008.pdf?src-supplier=Digikey; ComponentLink4Description: https://datasheet.ciiva.com/2810/cd00274221-2810008.pdf?src-supplier=Digikey; ComponentLink5URL: https://datasheet.ciiva.com/2810/cd00274221-2810010.pdf?src-supplier=Digikey; ComponentLink5Description: https://datasheet.ciiva.com/2810/cd00274221-2810010.pdf?src-supplier=Digikey; ComponentLink6URL: https://datasheet.ciiva.com/48495/cd00274221-48495849.pdf?src-supplier=Avnet; ComponentLink6Description: https://datasheet.ciiva.com/48495/cd00274221-48495849.pdf?src-supplier=Avnet; ComponentLink7URL: https://datasheet.ciiva.com/3271/cd00274221-3271807.pdf?src-supplier=Avnet; ComponentLink7Description: https://datasheet.ciiva.com/3271/cd00274221-3271807.pdf?src-supplier=Avnet; ComponentLink8URL: https://datasheet.ciiva.com/16216/cd00274221-16216362.pdf?src-supplier=Future+Electronics; ComponentLink8Description: https://datasheet.ciiva.com/16216/cd00274221-16216362.pdf?src-supplier=Future+Electronics; Manufacturer Part Number: LIS3DHTR; house_part_number: LIS3DHTR; Supplier 1: LCSC; Supplier Part Number 1: C15134
U8 = TMAG5273A2QDBVR: 3-Axis Hall sensor, I2C, SOT-23-6; Manufacturer: Texas Instruments; Supplier 1: LCSC; RoHS: No; Category: Integrated Circuits (ICs); Stock 1: 2055; Pricing 1: 1=0.7697, 10=0.6247, 30=0.5507, 100=0.4782, 500=0.4242, 1000=0.4011 (USD); Supplier Part Number 1: C3715882; Package: SOT-23-6; Manufacturer Part Number: TMAG5273A2QDBVR
Y1 = TAXM12M4RLBDDT2T: 12 MHz, 10 ppm, 20 pF, 3225 Crystal; Supplier 1: LCSC; Supplier Part Number 1: C133334; house_part_number: TAXM12M4RLBDDT2T; Manufacturer Part Number: TAXM12M4RLBDDT2T

## Nets that join several sheets
+3.3V: power (8 pins), lamp_controller (50 pins)
+5V: power (C58.2 U9.5), lamp_controller (J8.5)
+12V_SWITCHED: power (10 pins), lamp_controller (J6.1 J7.2 J10.2)
+24V: power (6 pins), lamp_controller (J2.1)
GND: power (63 pins), lamp_controller (109 pins)
+12V_ENABLE: power (R16.1), lamp_controller (U3.9)
+12V_VSENSE: power (C46.2 R19.1 R21.2 TP19.1), lamp_controller (U3.39)
+24V_ENABLE: power (TP22.1 U6.3), lamp_controller (U3.18)
+24V_VSENSE: power (C47.2 R20.1 R27.2 TP20.1), lamp_controller (U3.41)
SCL: power (U1.7), lamp_controller (R31.2 U3.5 U7.4 U8.1)
SDA: power (U1.8), lamp_controller (R32.2 U3.4 U7.6 U8.6)
USB0_D+: power (J1.A6 J1.B6 U4.4), lamp_controller (R25.2)
USB0_D-: power (J1.A7 J1.B7 U4.3), lamp_controller (R26.2)
VBUS_VSENSE: power (C45.2 R1.1 R6.2 TP6.1), lamp_controller (U3.38)

## Assembly variants
default_variant: not fitted C? J4 J5 J11 M1 R3 R? SW5 SW6